# EAGLE schematic Esquema (EAGLE 5.11)
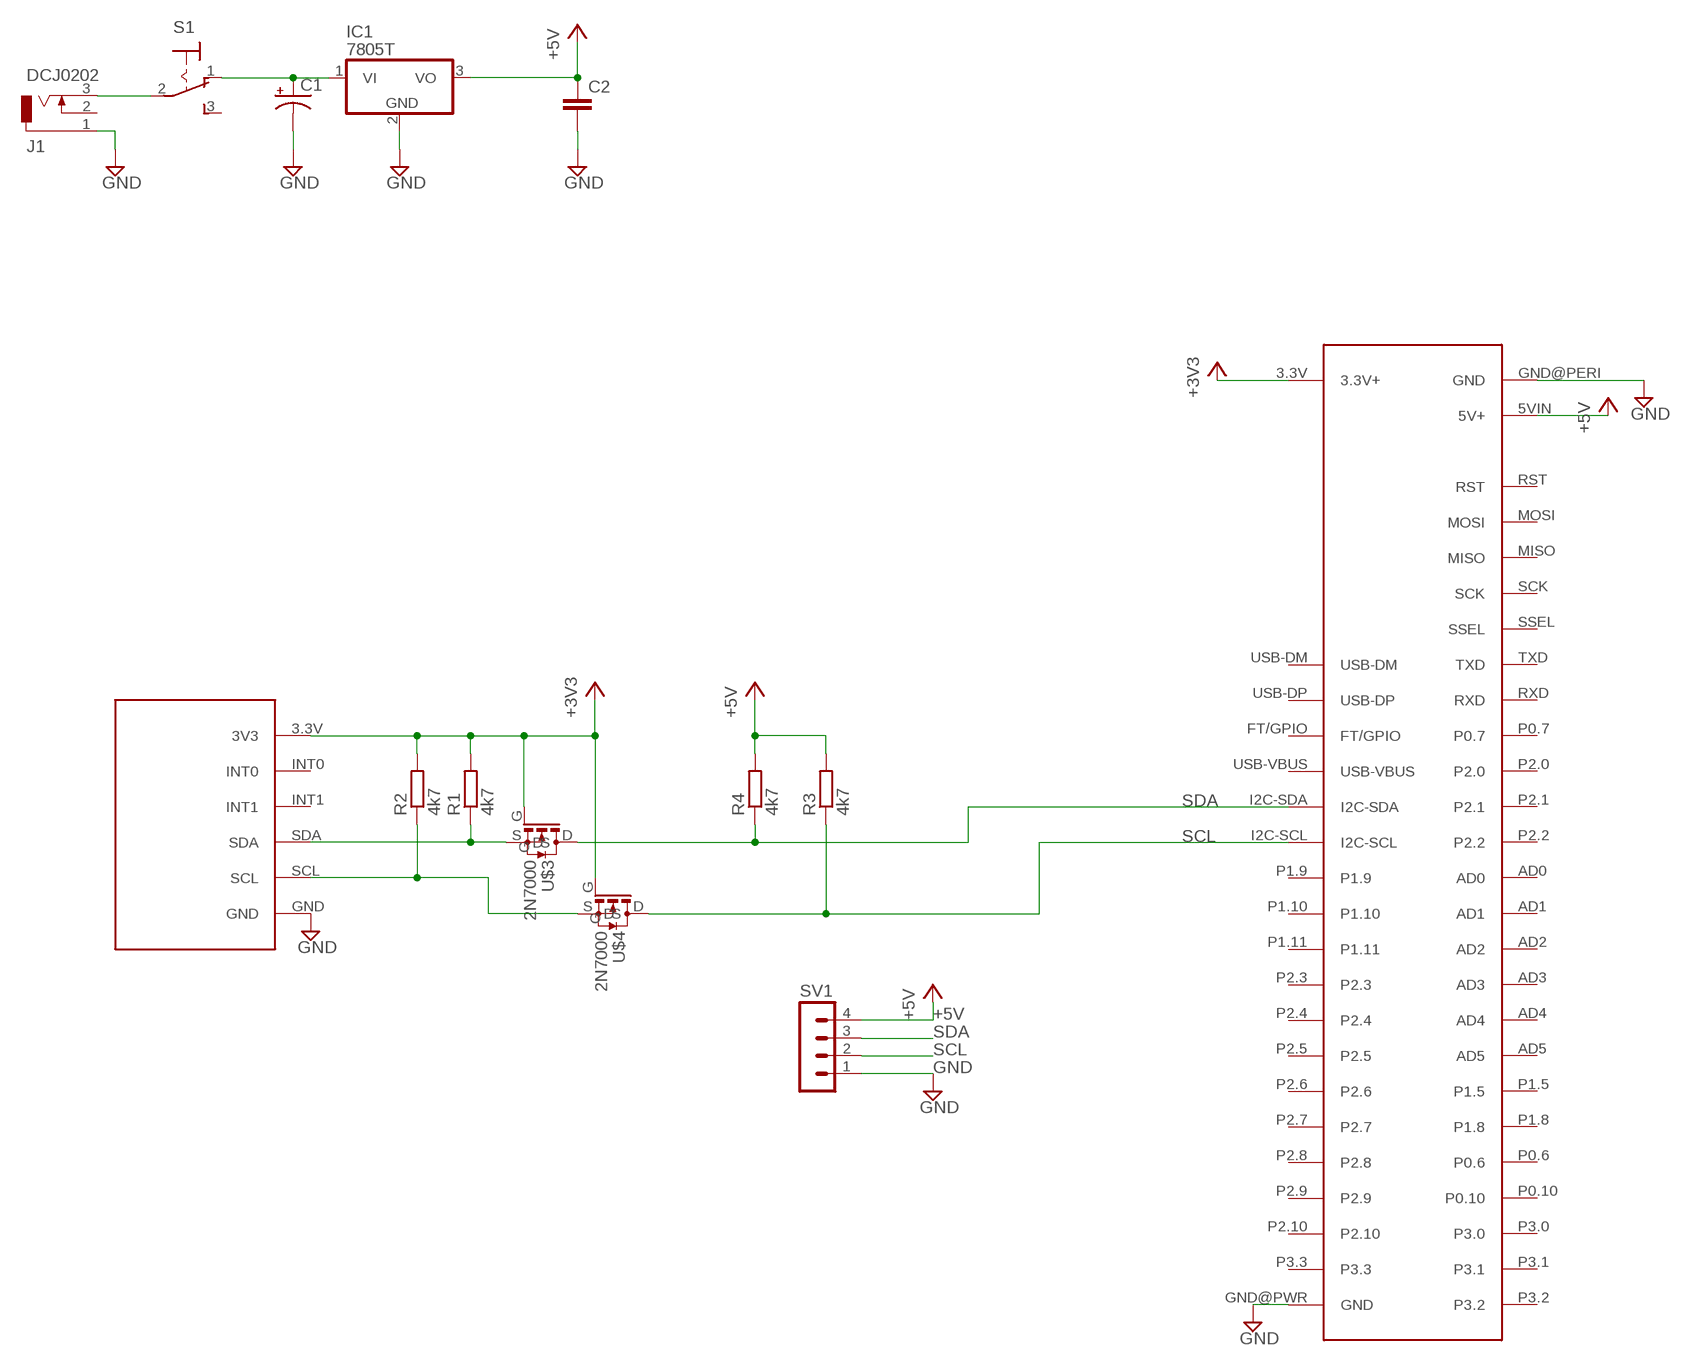
[diagram p0: schematic, sheet 1]

## Parts
C1  CPOL-USE1.8-4  [E1,8-4]
C2  C-EU050-024X044  [C050-024X044]
IC1  7805T  [TO220H]
J1  DCJ0202  [DCJ0202]
R1  4k7  R-EU_0207/2V  [0207/2V]
R2  4k7  R-EU_0207/2V  [0207/2V]
R3  4k7  R-EU_0207/2V  [0207/2V]
R4  4k7  R-EU_0207/2V  [0207/2V]
S1  320-916  [320-916]
SV1  MA04-1  [MA04-1]
U$1  6DOFIMU  [6DOFIMU]
U$2  LPC1114  [LPC1114]
U$3  2N7000  [TO92-LINE]
U$4  2N7000  [TO92-LINE]

## Nets
+3V3: R1.2 R2.2 U$1.3.3V(3V3) U$2.3.3V(3.3V+) U$3.G U$4.G
+5V: C2.1 IC1.3(VO) R3.2 R4.2 SV1.4 U$2.5VIN(5V+)
GND: C1.- C2.2 IC1.2(GND) J1.1 SV1.1 U$1.GND U$2.GND@PERI(GND) U$2.GND@PWR(GND)
N$1: R2.1 U$1.SCL U$4.S
N$2: R1.1 U$1.SDA U$3.S
N$3: J1.3 S1.2(P)
N$5: C1.+ IC1.1(VI) S1.1(O)
SCL: R3.1 SV1.2 U$2.I2C-SCL U$4.D
SDA: R4.1 SV1.3 U$2.I2C-SDA U$3.D
Unconnected: J1.2 S1.3(S) U$1.INT0 U$1.INT1 U$2.AD0 U$2.AD1 U$2.AD2 U$2.AD3 U$2.AD4 U$2.AD5 U$2.FT/GPIO U$2.MISO U$2.MOSI U$2.P0.6 U$2.P0.7 U$2.P0.10 U$2.P1.5 U$2.P1.8 U$2.P1.9 U$2.P1.10 U$2.P1.11 U$2.P2.0 U$2.P2.1 U$2.P2.2 U$2.P2.3 U$2.P2.4 U$2.P2.5 U$2.P2.6 U$2.P2.7 U$2.P2.8 U$2.P2.9 U$2.P2.10 U$2.P3.0 U$2.P3.1 U$2.P3.2 U$2.P3.3 U$2.RST U$2.RXD U$2.SCK U$2.SSEL U$2.TXD U$2.USB-DM U$2.USB-DP U$2.USB-VBUS

## Library data of the parts
C1 = rcl:CPOL-US: POLARIZED CAPACITOR, American symbol
C2 = rcl:C-EU: CAPACITOR, European symbol
IC1 = linear:78*: Positive VOLTAGE REGULATOR Source: http://cache.national.com/ds/LM/LM78L05.pdf http://www.fairchildsemi.com/ds/LM/LM7805.pdf
J1 = con-jack:DCJ0202: DC POWER JACK Source: DCJ0202.pdf; OC_FARNELL: unknown; OC_NEWARK: unknown
R1-R4 = rcl:R-EU_: RESISTOR, European symbol
S1 = switch:320-916: TOGGLE SWITCH distributor RS Components
SV1 = con-lstb:MA04-1: PIN HEADER; OC_FARNELL: unknown; OC_NEWARK: unknown
U$1 = Controle:6DOFIMU
U$2 = Controle:LPC1114
U$3 U$4 = Controle:2N7000